# Altium schematic sheet Память.SchDoc
size 420 x 297 mm; Scale: 1:1; Разраб.: Иванов; Обозначение документа: АБВГ.123456.001 Э3; Пров.: Петров; Утв.: Сидоров; Наименование организации: ОАО "Концерн "МПО-Гидроприбор"; Перв. применение: АБВГ.123456.000; Наименование изделия 1: Плата; Наименование изделия 2: Схема электрическая; Наименование изделия 3: принципиальная; Нач. отд.: Нач. отд.; Фамилия нач. отд.: Сидоров
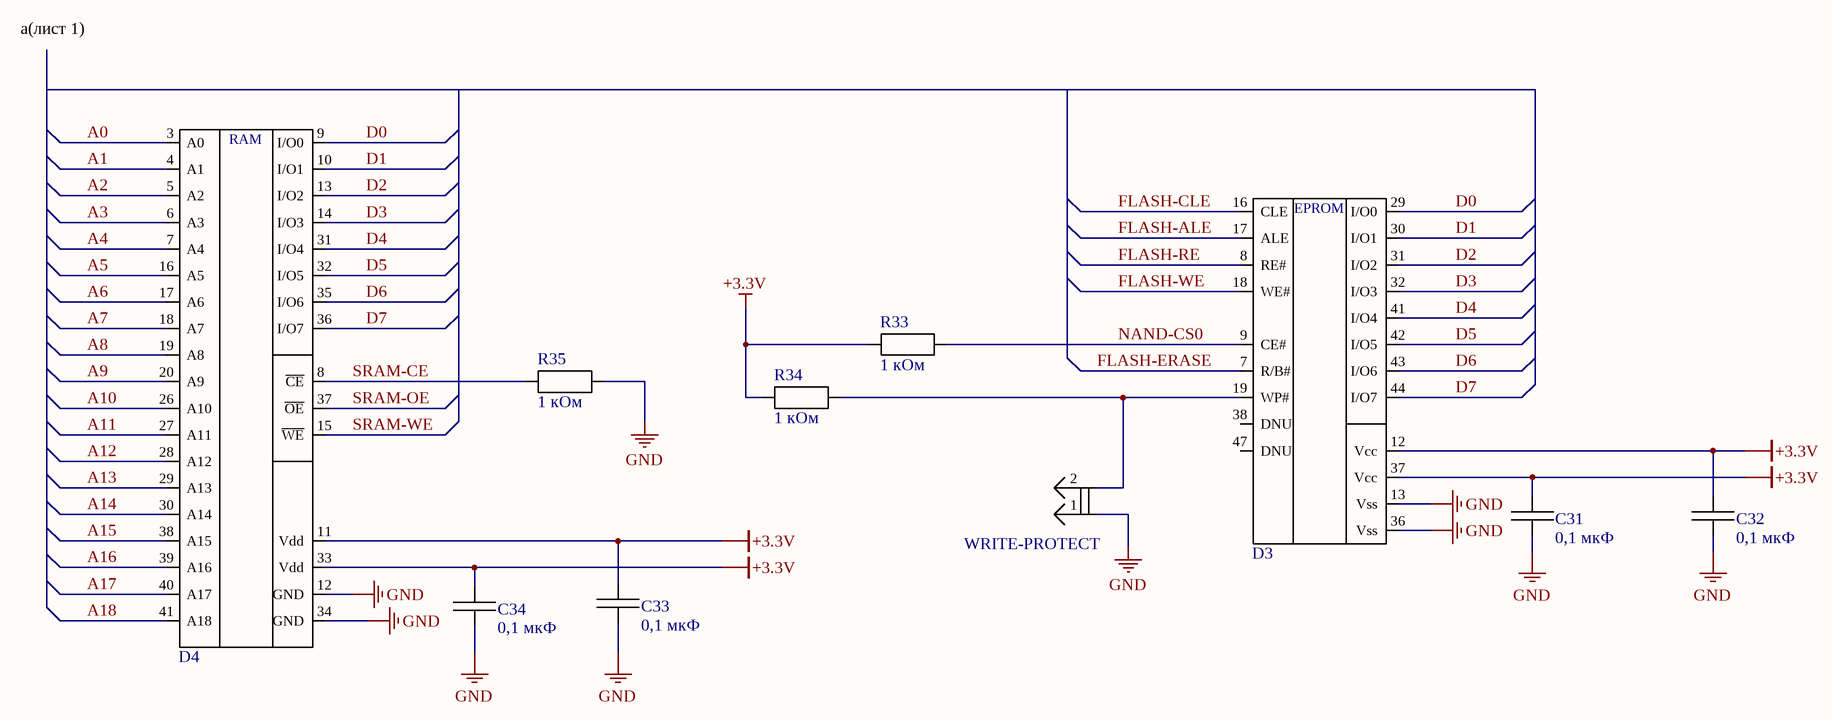
[diagram p0: Память.SchDoc]

## Parts
C31  0,1 мкФ  [0603-AVX]
C32  0,1 мкФ  [0603-AVX]
C33  0,1 мкФ  [0603-AVX]
C34  0,1 мкФ  [0603-AVX]
D3  (no value)  [TSOP_48(TYPE_1,CPL)]
D4  (no value)  [TSOP-44]
R33  1 кОм  [Р1-12-0,125]
R34  1 кОм  [Р1-12-0,125]
R35  1 кОм  [Р1-12-0,125]
WRITE-PROTECT  (no value)  [СНП346-2ВП21-1]

## Nets
+3.3V: C31.2 C32.2 C33.2 C34.2 D3.12(Vcc) D3.37(Vcc) D4.11(Vdd) D4.33(Vdd) R33.2 R34.2
GND: C31.1 C32.1 C33.1 C34.1 D3.13(Vss) D3.36(Vss) D4.12(GND) D4.34(GND) R35.2 WRITE-PROTECT.1
A0: D4.3(A0)
A1: D4.4(A1)
A2: D4.5(A2)
A3: D4.6(A3)
A4: D4.7(A4)
A5: D4.16(A5)
A6: D4.17(A6)
A7: D4.18(A7)
A8: D4.19(A8)
A9: D4.20(A9)
A10: D4.26(A10)
A11: D4.27(A11)
A12: D4.28(A12)
A13: D4.29(A13)
A14: D4.30(A14)
A15: D4.38(A15)
A16: D4.39(A16)
A17: D4.40(A17)
A18: D4.41(A18)
D0: D3.29(I/O0) D4.9(I/O0)
D1: D3.30(I/O1) D4.10(I/O1)
D2: D3.31(I/O2) D4.13(I/O2)
D3: D3.32(I/O3) D4.14(I/O3)
D4: D3.41(I/O4) D4.31(I/O4)
D5: D3.42(I/O5) D4.32(I/O5)
D6: D3.43(I/O6) D4.35(I/O6)
D7: D3.44(I/O7) D4.36(I/O7)
FLASH-ALE: D3.17(ALE)
FLASH-CLE: D3.16(CLE)
FLASH-ERASE: D3.7(R/B#)
FLASH-RE: D3.8(RE#)
FLASH-WE: D3.18(WE#)
NAND-CS0: D3.9(CE#) R33.1
SRAM-CE: D4.8(~{CE}) R35.1
SRAM-OE: D4.37(~{OE})
SRAM-WE: D4.15(~{WE})
NetD3_19: D3.19(WP#) R34.1 WRITE-PROTECT.2

Not connected (* = marked no-connect by the designer): D3 1(NC) 2(NC) 3(NC) 4(NC) 5(NC) 6(NC) 10(NC) 11(NC) 14(NC) 15(NC) 20(NC) 21(NC) 22(NC) 23(NC) 24(NC) 25(NC) 26(NC) 27(NC) 28(NC) 33(NC) 34(NC) 35(NC) 38(DNU) 39(NC) 40(NC) 45(NC) 46(NC) 47(DNU) 48(NC); D4 1(NC) 2(NC) 21(NC) 22(NC) 23(NC) 24(NC) 25(NC) 42(NC) 43(NC) 44(NC)

## Notes on the sheet
- а(лист 1)
- Перв. примен.
- Справ. №
- Подп. и дата
- Инв. № дубл.
- Взам. инв. №
- Разраб.
- Изм.
- Лист
- № докум.
- Подп.
- Дата
- Лит.
- Масса
- Масштаб
- Пров.
- Т.контр.
- Листов
- Инв. № подл.
- Утв.
- Н.контр.
- Копировал
- Формат А3
- (in symbol IS61WV5128BLL-10TLI) RAM
- (in symbol MT29F2G08ABAEAWPIT) EPROM

## Library data of the parts
C31-C34 = 0603-X7R-0,1мкФ-16В-10%: Manufacturer: AVX; ManufacturerPartNumber: 0603YC104KAT2A; TKE: X7R; Power/Voltage: 16 В; Tolerance: ±10%; Category: Конденсатор; Value: 0,1 мкФ; PartNumber: 0603YC104KAT2A
D3 = MT29F2G08ABAEAWPIT: Manufacturer: Micron; Categogy: Микросхема; ManufacturerPartNumber: MT29F2G08ABAEAWP IT
D4 = IS61WV5128BLL-10TLI: RAM память; Manufacturer: Micron; Categogy: Микросхема; ManufacturerPartNumber: IS61WV5128BLL-10TLI
R33-R35 = Р1-12-0,125-10,0 кОм±1%: PartNumber: АЛЯР.434110.005 ТУ; ManufacturerPartNumber: Р1-12-0,125-10,0 кОм±1%-Л; Tolerance: ±1%-Л; Power/Voltage: 0,125; Value: 1 кОм; Category: Резистор
WRITE-PROTECT = СНП346-2ВП21-1: ManufacturerPartNumber: Вилка СНП346-2ВП21-1; PartNumber: РЮМК.430420.011ТУ; Category: Соединитель